# Altium schematic sheet Full-Wave Rectifier.schdoc: Full-Wave Rectifier
size Letter; Date: 2017-01-26; DocumentNumber: 6; Revision: A; SheetNumber: 6; SheetTotal: 16; DesignedBy: Mike MacKay
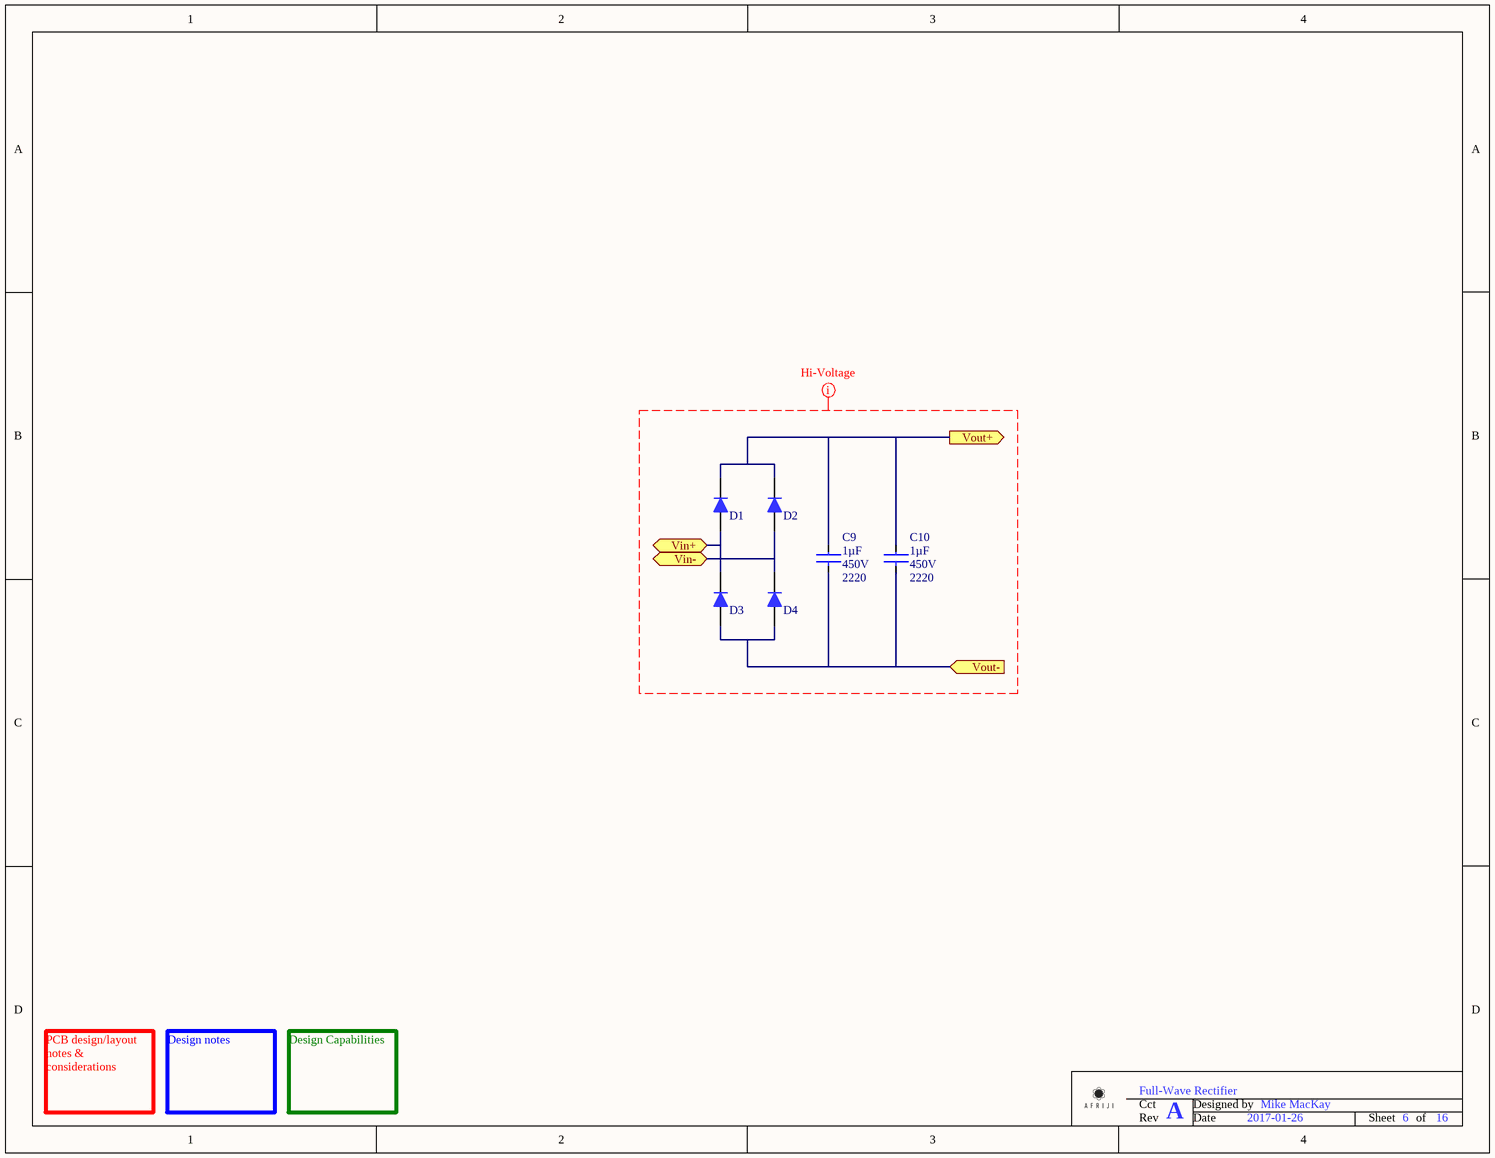
[diagram p0: Full-Wave Rectifier.schdoc]

## Parts
C9  Capacitance: 1µF  Voltage - Rated: 450V  Package / Case: 2220  [C2220 - Ceramic]  (hidden comment: 1uF 2220 450V)
C10  Capacitance: 1µF  Voltage - Rated: 450V  Package / Case: 2220  [C2220 - Ceramic]  (hidden comment: 1uF 2220 450V)
D1  (no value)  [SMA - Diode]
D2  (no value)  [SMA - Diode]
D3  (no value)  [SMA - Diode]
D4  (no value)  [SMA - Diode]

## Ports
Vin+ (bidir), Vin- (bidir), Vout+ (out), Vout- (in)

## Nets
Vin+: D1.1(Anode) D3.2(Cathode) ; port Vin+
Vin-: D2.1(Anode) D4.2(Cathode) ; port Vin-
Vout+: C9.2 C10.2 D1.2(Cathode) D2.2(Cathode) ; port Vout+
Vout-: C9.1 C10.1 D3.1(Anode) D4.1(Anode) ; port Vout-

## Layout directives
net class 171-250V: (no net found under the mark)

## Notes on the sheet
- PCB design/layout notes & considerations
- Design notes
- Design Capabilities
- Cct
- Designed by
- Rev
- Date
- Sheet
- of

## Library data of the parts
C9 C10 = 1uF 2220 450V: Manufacturer: TDK Corporation; Manufacturer Part Number: CGA9P4X7T2W105M250KE; Tolerance: ±20%; Temperature Coefficient: X7T; Supplier 1: Digi-Key; Supplier Part Number 1: 445-7998-1-ND; RoHS: RoHS Compliant; Category: Capacitors; Stock 1: 10247; Pricing 1: 1=3.11, 10=2.576, 100=2.1589, 250=1.78012 (USD); Packaging: Cut Tape (CT); Part Status: Active; Operating Temperature: -55°C ~ 125°C; Features: Soft Termination; Ratings: AEC-Q200; Applications: Automotive, Boardflex Sensitive; Failure Rate: -; Mounting Type: Surface Mount, MLCC; Size / Dimension: 0.224" L x 0.197" W (5.70mm x 5.00mm); Height - Seated (Max): -; Thickness (Max): 0.098" (2.50mm); Lead Spacing: -; Lead Style: -; ComponentLink1URL: https://product.tdk.com/info/en/catalog/datasheets/mlcc_automotive_soft_en.pdf; ComponentLink1Description: Spec Sheet; Value: 1uF 2220 450V
D1-D4 = Diode - Signal 1A: Signal Diode; Manufacturer: Vishay Semiconductor Diodes Division; Manufacturer Part Number: US1G-E3/5AT; Diode Type: Standard; Voltage - DC Reverse (Vr) (Max): 400V; Current - Average Rectified (Io): 1A; Voltage - Forward (Vf) (Max) @ If: 1V @ 1A; Speed: Fast Recovery =< 500ns, > 200mA (Io); Reverse Recovery Time (trr): 50ns; Current - Reverse Leakage @ Vr: 10µA @ 400V; Capacitance @ Vr, F: 15pF @ 4V, 1MHz; Supplier 1: Digi-Key; Supplier Part Number 1: US1G-E3/5ATGICT-ND; RoHS: RoHS Compliant; Category: Discrete Semiconductor Products; Stock 1: 29002; Pricing 1: 1=0.41, 10=0.312, 25=0.2816, 100=0.1945, 250=0.1638, 500=0.1331, 1000=0.10238, 2500=0.09214 (USD); Packaging: Cut Tape (CT); Part Status: Active; Mounting Type: Surface Mount; Package / Case: DO-214AC, SMA; Supplier Device Package: DO-214AC (SMA); Operating Temperature - Junction: -55°C ~ 150°C; ComponentLink1URL: http://www.vishay.com/docs/88768/us1.pdf; ComponentLink1Description: Spec Sheet